# EAGLE design status_led_base (EAGLE 6.6.0)
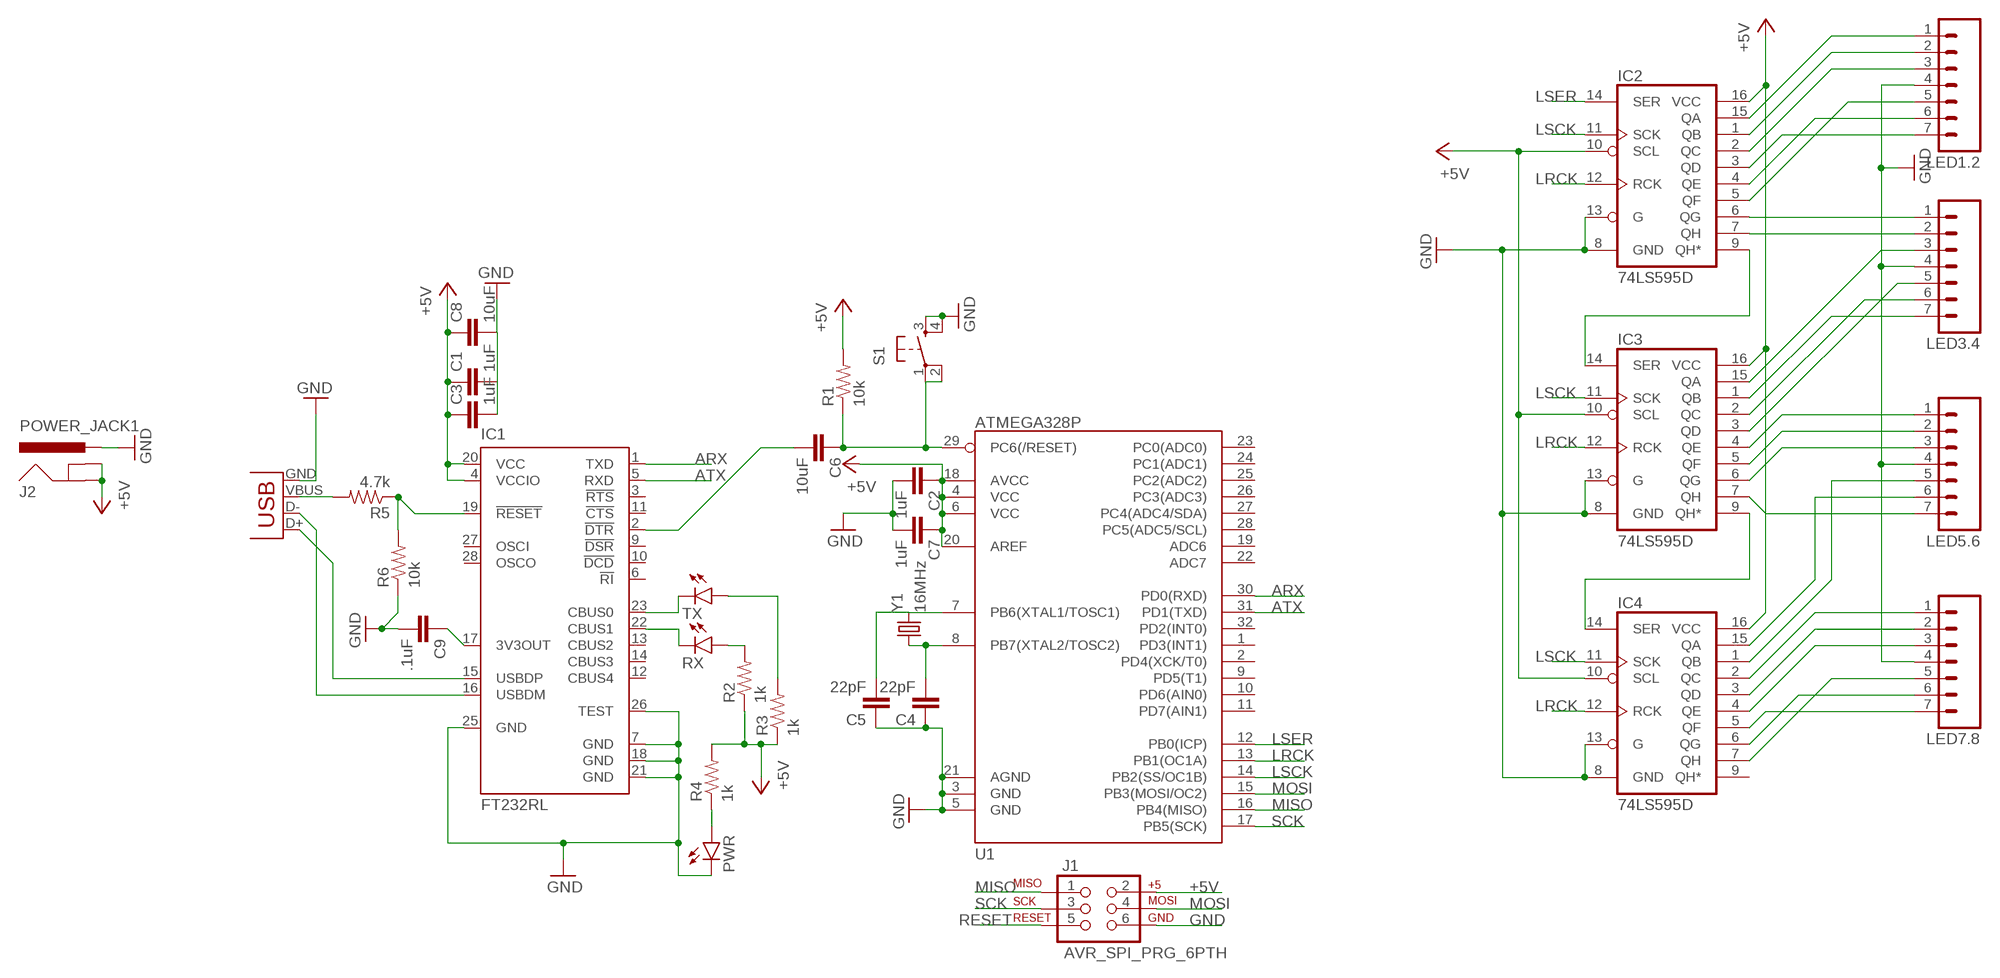
[diagram p0: schematic, sheet 1]

## Parts
C1  1uF  CAP0603-CAP  [0603-CAP]
C2  1uF  CAP0603-CAP  [0603-CAP]
C3  1uF  CAP0603-CAP  [0603-CAP]
C4  22pF  CAP0603-CAP  [0603-CAP]
C5  22pF  CAP0603-CAP  [0603-CAP]
C6  10uF  CAP0603-CAP  [0603-CAP]
C7  1uF  CAP0603-CAP  [0603-CAP]
C8  10uF  CAP0603-CAP  [0603-CAP]
C9  .1uF  CAP0603-CAP  [0603-CAP]
IC1  FT232RL  [SSOP28]
IC2  74LS595D  [SO16]
IC3  74LS595D  [SO16]
IC4  74LS595D  [SO16]
J1  AVR_SPI_PRG_6PTH  [2X3]
J2  POWER_JACK1  [POWER_JACK_SMD_OVERPASTE_REDBOARD_0603]
JP1  USBSMD  [USB-MINIB]
LED1.2  M07  [1X07]
LED3.4  M07  [1X07]
LED5.6  M07  [1X07]
LED7.8  M07  [1X07]
PWR  LED0603  [LED-0603]
R1  10k  RESISTOR0603-RES  [0603-RES]
R2  1k  RESISTOR0603-RES  [0603-RES]
R3  1k  RESISTOR0603-RES  [0603-RES]
R4  1k  RESISTOR0603-RES  [0603-RES]
R5  4.7k  RESISTOR0603-RES  [0603-RES]
R6  10k  RESISTOR0603-RES  [0603-RES]
RX  LED0603  [LED-0603]
S1  TAC_SWITCHSMD  [TACTILE-SWITCH-SMD]
TX  LED0603  [LED-0603]
U1  ATMEGA328P  ATMEGA328_SMT  [TQFP32-08]
Y1  16MHz  CRYSTALSMD  [HC49UP]

## Nets
+5V: C1.1 C2.1 C3.1 C7.1 C8.1 IC1.4(VCCIO) IC1.20(VCC) IC2.10(SCL) IC2.16(VCC) IC3.10(SCL) IC3.16(VCC) IC4.10(SCL) IC4.16(VCC) J1.2 J2.GND(GNDBREAK) J2.P$4(GND) R1.2 R2.1 R3.1 R4.2 U1.4(VCC) U1.6(VCC) U1.18(AVCC) U1.20(AREF)
ARX: IC1.1(TXD) U1.30(PD0(RXD))
ATX: IC1.5(RXD) U1.31(PD1(TXD))
GND: C1.2 C2.2 C3.2 C4.1 C5.1 C7.2 C8.2 C9.2 IC1.7(GND) IC1.18(GND) IC1.21(GND) IC1.25(GND) IC1.26(TEST) IC2.8(GND) IC2.13(G) IC3.8(GND) IC3.13(G) IC4.8(GND) IC4.13(G) J1.6 J2.VIN0(PWR) JP1.GND LED1.2.4 LED3.4.4 LED5.6.4 LED7.8.4 PWR.C R6.1 S1.3 S1.4 U1.3(GND) U1.5(GND) U1.21(AGND)
LRCK: IC2.12(RCK) IC3.12(RCK) IC4.12(RCK) U1.13(PB1(OC1A))
LSCK: IC2.11(SCK) IC3.11(SCK) IC4.11(SCK) U1.14(PB2(SS/OC1B))
LSER: IC2.14(SER) U1.12(PB0(ICP))
MISO: J1.1 U1.16(PB4(MISO))
MOSI: J1.4 U1.15(PB3(MOSI/OC2))
N$1: IC1.16(USBDM) JP1.D-
N$2: IC1.15(USBDP) JP1.D+
N$3: IC4.15(QA) LED5.6.6
N$4: R3.2 TX.A
N$5: R2.2 RX.A
N$6: C6.2 IC1.2(!DTR)
N$7: PWR.A R4.1
N$8: IC2.15(QA) LED1.2.1
N$9: IC1.23(CBUS0) TX.C
N$10: IC1.22(CBUS1) RX.C
N$11: C9.1 IC1.17(3V3OUT)
N$12: JP1.VBUS R5.2
N$13: C5.2 U1.7(PB6(XTAL1/TOSC1)) Y1.2
N$14: C4.2 U1.8(PB7(XTAL2/TOSC2)) Y1.1
N$15: IC2.1(QB) LED1.2.2
N$16: IC2.2(QC) LED1.2.3
N$17: IC2.3(QD) LED1.2.7
N$18: IC2.4(QE) LED1.2.6
N$19: IC2.5(QF) LED1.2.5
N$20: IC2.9(QH*) IC3.14(SER)
N$21: IC3.9(QH*) IC4.14(SER)
N$23: IC2.6(QG) LED3.4.1
N$24: IC2.7(QH) LED3.4.2
N$25: IC3.15(QA) LED3.4.3
N$26: IC3.1(QB) LED3.4.7
N$27: IC3.2(QC) LED3.4.6
N$28: IC3.3(QD) LED3.4.5
N$29: IC3.4(QE) LED5.6.1
N$30: IC3.5(QF) LED5.6.2
N$31: IC3.6(QG) LED5.6.3
N$32: IC3.7(QH) LED5.6.7
N$33: IC4.1(QB) LED5.6.5
N$34: IC4.2(QC) LED7.8.1
N$35: IC4.3(QD) LED7.8.2
N$36: IC4.4(QE) LED7.8.3
N$37: IC4.5(QF) LED7.8.7
N$38: IC4.6(QG) LED7.8.6
N$39: IC4.7(QH) LED7.8.5
N$40: IC1.19(!RESET) R5.1 R6.2
RESET: C6.1 J1.5 R1.1 S1.1 S1.2 U1.29(PC6(/RESET))
SCK: J1.3 U1.17(PB5(SCK))
Unconnected: IC1.3(!RTS) IC1.6(!RI) IC1.9(!DSR) IC1.10(!DCD) IC1.11(!CTS) IC1.12(CBUS4) IC1.13(CBUS2) IC1.14(CBUS3) IC1.27(OSCI) IC1.28(OSCO) IC4.9(QH*) U1.1(PD3(INT1)) U1.2(PD4(XCK/T0)) U1.9(PD5(T1)) U1.10(PD6(AIN0)) U1.11(PD7(AIN1)) U1.19(ADC6) U1.22(ADC7) U1.23(PC0(ADC0)) U1.24(PC1(ADC1)) U1.25(PC2(ADC2)) U1.26(PC3(ADC3)) U1.27(PC4(ADC4/SDA)) U1.28(PC5(ADC5/SCL)) U1.32(PD2(INT0))

## Library data of the parts
C1-C9 = SparkFun-Capacitors:CAP: Capacitor Standard 0603 ceramic capacitor, and 0.1" leaded capacitor.
IC1 = ftdichip:FT232R: Source: http://www.ftdichip.com/Documents/DataSheets/DS_FT232R_v104.pdf; MPN: FT232RL; OC_FARNELL: 1146032; OC_NEWARK: 91K9918
IC2-IC4 = SparkFun-DigitalIC:74*595: 8-bit SHIFT REGISTER, output latch; PROD_ID: IC-07875
J1 = SparkFun-Connectors:AVR_SPI_PRG_6: AVR ISP 6 Pin This is the reduced ISP connector for AVR programming. Common on Arduino. This footprint will take up less PCB space and can be used with a 10-pin to 6-pin adapter such as SKU: BOB-08508 **Special note about "TEST_POINT" package. The stop mask is on the top side, so if you want your programming test points to be on the bottom of your board, make sure to place this package on the bottom side of the board. This also ensure that the orientation to program from the bottom side will be correct.
J2 = SparkFun-Connectors:POWER_JACK: Power Jack This is the standard 5.5mm barrel jack for power. The PTH is the most common, proven, reliable, footprint. The Slot footprint only works if the mill layer is transmitted to the PCB fab house so be warned. Mating wall wart : TOL-00298 (and others)
JP1 = SparkFun-Connectors:USB: USB Connectors USB-B-PTH is fully proven SKU : PRT-00139/CONN-08278 USB-miniB is fully proven SKU : PRT-00587 USB-A-PCB is untested. USB-A-H is throughly reviewed, but untested. Spark Fun Electronics SKU : PRT-00437 USB-B-SMT is throughly reviewed, but untested. Needs silkscreen touching up. USB-A-S has not been used/tested USB-MB-H has not been used/tested USB-MICROB has been used. CONN-09505; PROD_ID: CONN-08193
LED1.2 LED3.4 LED5.6 LED7.8 = SparkFun-Connectors:M07: Header 7 Standard 7-pin 0.1" header. Use with straight break away headers (SKU : PRT-00116), right angle break away headers (PRT-00553), swiss pins (PRT-00743), machine pins (PRT-00117), and female headers (PRT-00115). NOTES ON THE VARIANTS LOCK and LOCK_LONGPADS... This footprint was designed to help hold the alignment of a through-hole component (i.e. 7-pin header) while soldering it into place. You may notice that each hole has been shifted either up or down by 0.005 of an inch from it's more standard position (which is usually a perfectly straight line). This slight alteration caused the pins (the squares in the middle) to touch the edges of the holes. Because they are alternating, it causes a "brace" to hold the header in place. 0.005 has proven to be the perfect amount of "off-center" position when using our standard breakaway headers. Although looks a little odd when you look at the bare footprint, once you have a header in there, the alteration is very hard to notice. Also, if you push a header all the way into place, it is covered up entirely on the bottom side. This idea of altering the position of holes to aid alignment will be further integrated into the Sparkfun Library for other footprints. It can help hold any component with 3 or more connection pins.
PWR RX TX = SparkFun-LED:LED: LEDs Standard schematic elements and footprints for 5mm, 3mm, 1206, and 0603 sized LEDs. 5mm - Spark Fun Electronics SKU : COM-00529 (and others)
R1-R6 = SparkFun-Passives:RESISTOR: Resistor Basic schematic elements and footprints for 0603, 1206, and PTH resistors.
S1 = SparkFun-Electromechanical:TAC_SWITCH: Momentary Switch Button commonly used for reset or general input. Spark Fun Electronics SKU : COM-00097 SMT- SWCH-08247
U1 = SparkFun-DigitalIC:ATMEGA328_SMT: 32-Pin Atmega328 part Commonly used on Arduino compatible boards Available in QFP and QFN packages TQFP is IC-09069 QFN is non-stock; PROD_ID: IC-09069
Y1 = SparkFun-FreqCtrl:CRYSTAL: Various standard crystals. Proven footprints. Spark Fun Electronics SKU : COM-00534

## Board
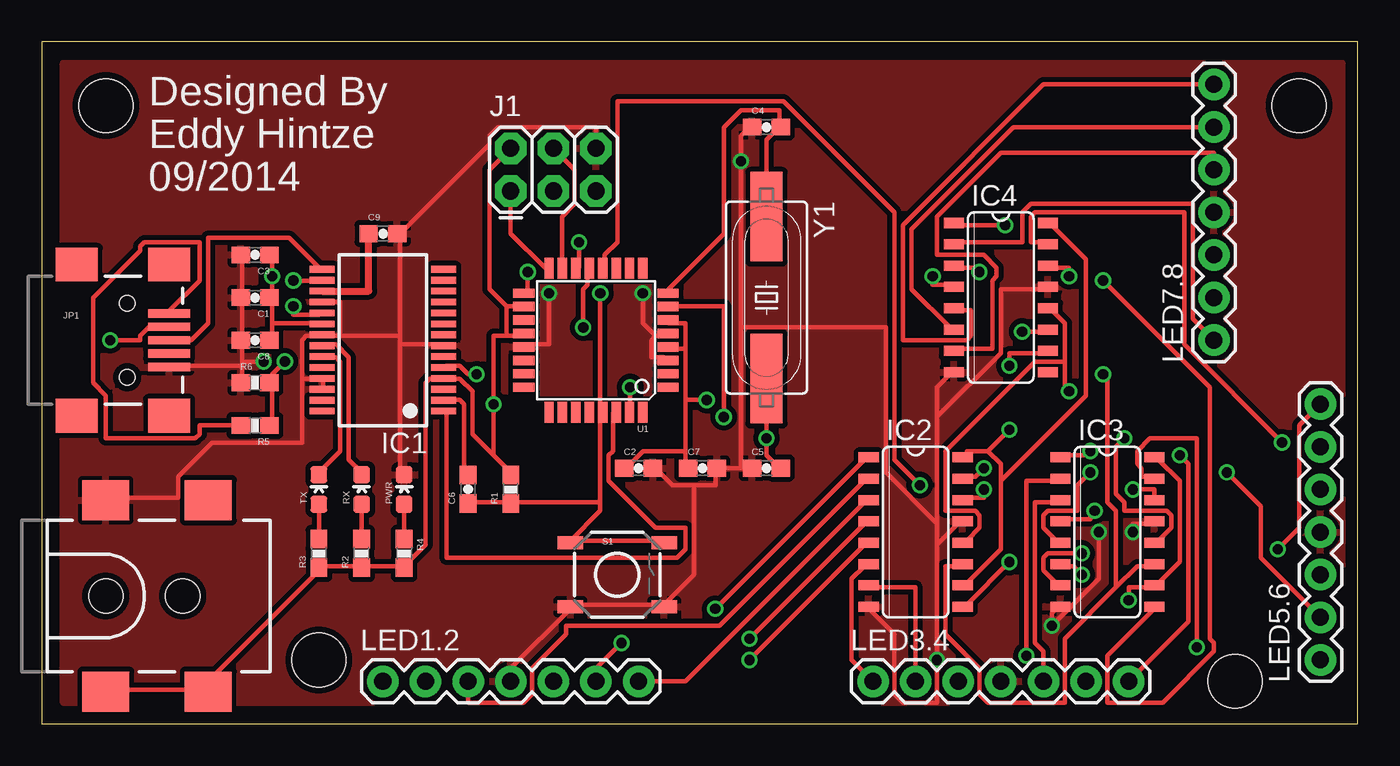
[diagram p1: board, top side]
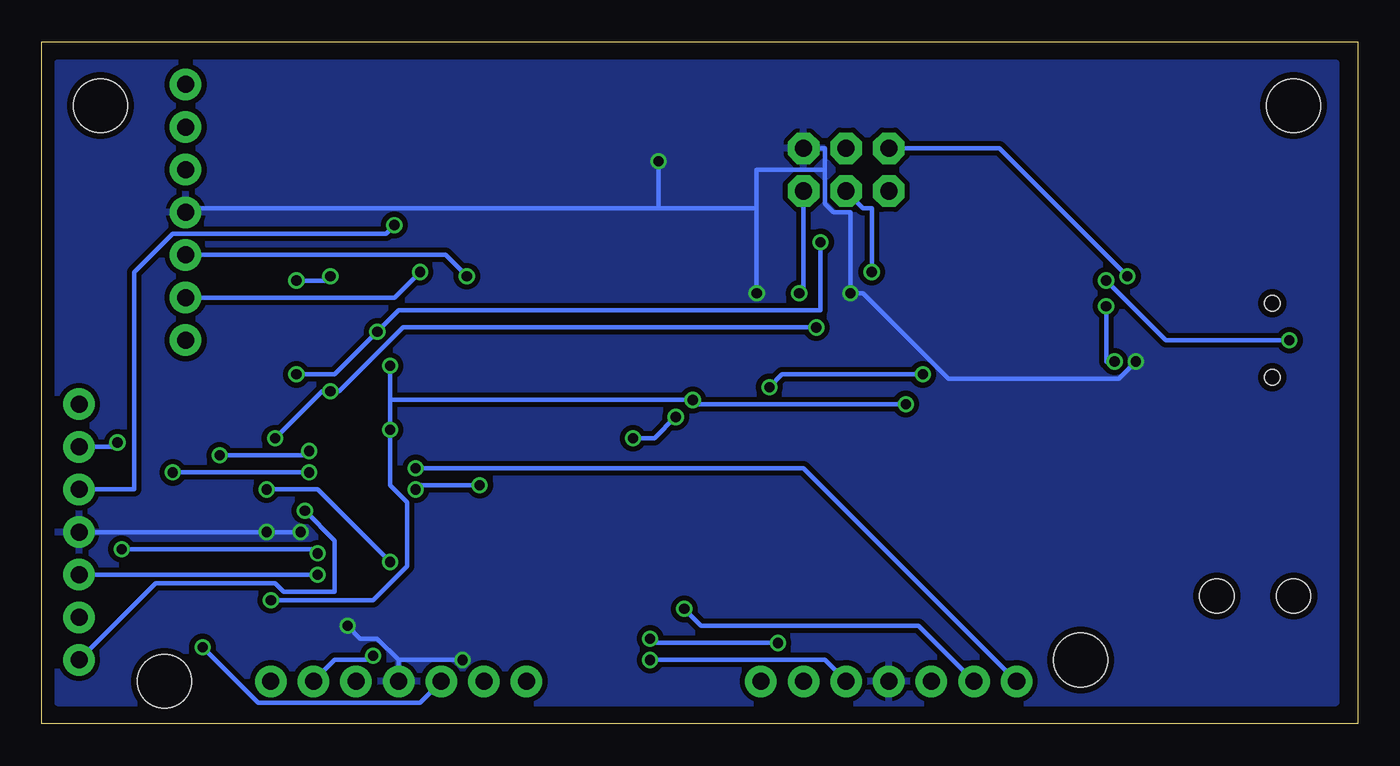
[diagram p2: board, bottom side, seen from below]

Size 78.41 x 40.63 mm. Coordinates in mm from the lower left corner, seen from the top.
Outline: 0,0 78.41,0 78.41,40.63 0,40.63 0,0
Copper layers (1*16): Top 0.0356mm / dielectric 1.5011mm / Bottom 0.0356mm
Design rules "LaenPCBOrder": minimum track width 6mil, minimum drill 13mil, track to track 6mil, track to pad 6mil, pad to pad 6mil, via to via 6mil, smd to smd 6mil, copper to edge 15mil, drill to drill 6mil, minimum pad ring 7mil, minimum via ring 7mil, stop-mask expansion 3mil, vias tented up to drill 0mil, thermal gap 10mil
Holes 3.2 mm at 3.81,36.83 74.93,36.83 71.12,2.54 16.51,3.81

### Footprints (pad centres in the part's own frame; a part is rotated, then mirrored left to right if it is on the bottom)
0603-CAP = smd 1.1 x 1: 1 -0.85,0; 2 0.85,0
SSOP28 = smd 0.4 x 1.5: 1 -4.225,-3.625; 2 -3.575,-3.625; 3 -2.925,-3.625; 4 -2.275,-3.625; 5 -1.625,-3.625; 6 -0.975,-3.625; 7 -0.325,-3.625; 8 0.325,-3.625; 9 0.975,-3.625; 10 1.625,-3.625; 11 2.275,-3.625; 12 2.925,-3.625; 13 3.575,-3.625; 14 4.225,-3.625; 15 4.225,3.625; 16 3.575,3.625; 17 2.925,3.625; 18 2.275,3.625; 19 1.625,3.625; 20 0.975,3.625; 21 0.325,3.625; 22 -0.325,3.625; 23 -0.975,3.625; 24 -1.625,3.625; 25 -2.275,3.625; 26 -2.925,3.625; 27 -3.575,3.625; 28 -4.225,3.625
SO16 = smd 0.6 x 1.2: 1 -4.445,-2.8; 2 -3.175,-2.8; 3 -1.905,-2.8; 4 -0.635,-2.8; 5 0.635,-2.8; 6 1.905,-2.8; 7 3.175,-2.8; 8 4.445,-2.8; 9 4.445,2.8; 10 3.175,2.8; 11 1.905,2.8; 12 0.635,2.8; 13 -0.635,2.8; 14 -1.905,2.8; 15 -3.175,2.8; 16 -4.445,2.8
2X3 = drill 1.016 pad 1.88 octagon: 1 0,0; 2 0,2.54; 3 2.54,0; 4 2.54,2.54; 5 5.08,0; 6 5.08,2.54
POWER_JACK_SMD_OVERPASTE_REDBOARD_0603 = smd 2.8 x 2.4: GND 0,-5.7; P$4 6.1,-5.7; VIN0 0,5.7; VIN1 6.1,5.7 | hole 2.032: 0,0; 4.572,0
USB-MINIB = smd 2.5 x 0.5: D+ 2.5,0; D- 2.5,0.8; GND 2.5,-1.6; ID 2.5,-0.8; VBUS 2.5,1.6 | smd 2.5 x 2: MTN1 -3,4.5; MTN2 2.5,4.5; MTN3 -3,-4.5; MTN4 2.5,-4.5 | hole 0.9: 0,2.2; 0,-2.2
1X07 = drill 1.016 pad 1.88: 1 0,0; 2 2.54,0; 3 5.08,0; 4 7.62,0; 5 10.16,0; 6 12.7,0; 7 15.24,0
LED-0603 = smd 1 x 1: A 0,-0.877; C 0,0.877
0603-RES = smd 1.1 x 1: 1 -0.85,0; 2 0.85,0
TACTILE-SWITCH-SMD = smd 1.524 x 0.762: 1 -2.794,1.905; 2 2.794,1.905; 3 -2.794,-1.905; 4 2.794,-1.905
TQFP32-08 = smd 1.27 x 0.559: 1 -4.293,2.8; 2 -4.293,2; 3 -4.293,1.2; 4 -4.293,0.4; 5 -4.293,-0.4; 6 -4.293,-1.2; 7 -4.293,-2; 8 -4.293,-2.8; 17 4.293,-2.8; 18 4.293,-2; 19 4.293,-1.2; 20 4.293,-0.4; 21 4.293,0.4; 22 4.293,1.2; 23 4.293,2; 24 4.293,2.8 | smd 0.559 x 1.27: 9 -2.8,-4.293; 10 -2,-4.293; 11 -1.2,-4.293; 12 -0.4,-4.293; 13 0.4,-4.293; 14 1.2,-4.293; 15 2,-4.293; 16 2.8,-4.293; 25 2.8,4.293; 26 2,4.293; 27 1.2,4.293; 28 0.4,4.293; 29 -0.4,4.293; 30 -1.2,4.293; 31 -2,4.293; 32 -2.8,4.293
HC49UP = smd 5.334 x 1.93: 1 -4.826,0; 2 4.826,0

### Placement (x,y rotation side)
C1  12.7,25.4 180 top
C2  35.56,15.24 0 top
C3  12.7,27.94 180 top
C4  43.18,35.56 0 top
C5  43.18,15.24 0 top
C6  25.4,13.97 90 top
C7  39.37,15.24 0 top
C8  12.7,22.86 180 top
C9  20.32,29.21 0 top
IC1  20.32,22.86 90 top
IC2  52.07,11.43 270 top
IC3  63.5,11.43 270 top
IC4  57.15,25.4 270 top
J1  27.94,31.75 0 top
J2  3.81,7.62 0 top
JP1  5.08,22.86 0 top
LED1.2  20.32,2.54 0 top
LED3.4  49.53,2.54 0 top
LED5.6  76.2,3.81 90 top
LED7.8  69.85,22.86 90 top
PWR  21.59,13.97 0 top
R1  27.94,13.97 90 top
R2  19.05,10.16 90 top
R3  16.51,10.16 90 top
R4  21.59,10.16 270 top
R5  12.7,17.78 180 top
R6  12.7,20.32 0 top
RX  19.05,13.97 0 top
S1  34.29,8.89 0 top
TX  16.51,13.97 0 top
U1  33.02,22.86 180 top
Y1  43.18,25.4 270 top

### Tracks (layer width: path | path; a pad name or v marks a point on that pad's centre or on a via)
+5V  (via drill 0.61)
  Top 0.254: 38.35,16.26 35.81,16.26 34.8,15.24 C2.1 | 38.35,16.26 38.35,15.24 C7.1 | 38.35,22.35 37.34,22.35 U1.4 | 38.35,16.26 38.35,19.3 | 38.35,19.3 38.35,22.35 | 38.35,22.35 38.35,23.88 37.34,23.88 U1.6 | IC3.16 66.55,15.75 67.82,14.48 67.82,9.65 66.55,8.38 IC3.10 66.29,8.13 64.77,8.13 v64.77,7.37 | 57.15,14.48 57.15,15.49 56.39,16.26 | 57.15,14.48 57.15,10.41 55.12,8.38 IC2.10 | 56.39,16.26 55.12,16.26 55.12,16 IC2.16 | v57.66,21.34 57.66,22.1 59.94,22.1 IC4.10 | 56.39,16.26 v57.66,17.53 | 57.15,14.48 62.23,19.56 62.23,27.69 60.2,29.72 IC4.16 | v39.62,19.3 38.35,19.3 | 19.05,9.4 16.51,9.4 R3.1 16.51,9.14 10.16,2.79 10.16,2.03 J2.P$4 9.91,2.03 3.81,2.03 J2.GND | 19.05,9.4 21.59,9.4 | 19.05,9.4 R2.1 | 13.72,25.4 13.72,23.88 | 13.72,23.88 13.72,22.86 C8.1 | 13.72,25.4 v13.72,26.67 13.72,27.94 C3.1 | 13.72,25.4 C1.1 | 13.72,23.88 16.51,23.88 IC1.20 | 26.92,16 25.65,17.27 25.65,19.81 24.89,20.57 24.13,20.57 IC1.4 23.88,20.57 23.11,20.57 22.86,20.32 22.86,10.67 21.59,9.4 | 26.92,16 27.94,14.99 R1.2 | 27.69,23.11 26.92,23.11 v26.92,19.05 26.92,16 | 27.69,23.11 28.7,23.11 U1.20 | 27.69,24.89 28.7,24.89 U1.18 | 27.69,23.11 27.69,24.89 | J1.2 26.67,33.02 26.67,25.91 27.69,24.89 | 21.59,9.4 R4.2
  Bottom 0.254: 57.66,19.3 v57.66,17.53 57.66,14.22 56.64,13.21 56.64,9.4 58.67,7.37 v64.77,7.37 | 57.66,19.3 v57.66,21.34 | 57.66,19.3 v39.62,19.3 39.37,19.05 v26.92,19.05 | v13.72,26.67 21.34,34.29 J1.2
ARX
  Top 0.254: U1.30 34.04,18.54 34.04,16.26 33.78,16 33.78,14.48 36.58,11.68 38.35,11.68 38.35,10.41 37.85,9.91 24.13,9.91 24.13,18.54 IC1.1
ATX  (via drill 0.61)
  Top 0.254: v35.05,20.07 35.05,18.8 U1.31 | v25.91,20.83 25.4,20.83 24.89,21.34 24.13,21.34 IC1.5
  Bottom 0.254: v35.05,20.07 34.29,20.83 v25.91,20.83
GND  (via drill 0.61)
  Top 0.254: 37.08,7.11 31.5,7.11 S1.3 31.5,6.86 27.94,3.3 LED1.2.4 | 38.86,14.22 40.13,14.22 40.13,15.24 C7.2 41.66,15.24 | 38.86,14.22 37.59,14.22 36.58,15.24 C2.2 | 41.66,15.24 C5.1 | 41.66,15.24 41.66,23.62 | 41.66,23.62 v41.66,33.53 41.66,35.05 42.16,35.56 C4.1 | 37.08,7.11 38.86,8.89 38.86,14.22 | 37.08,7.11 S1.4 | v65.02,11.43 65.02,11.94 66.29,11.94 IC3.13 | IC3.8 60.45,6.86 60.2,6.6 v60.2,5.84 62.99,8.64 v62.99,11.43 | 53.34,10.67 v53.34,3.81 53.34,1.27 51.31,1.27 50.8,1.78 50.8,5.33 49.28,6.86 IC2.8 | 53.34,10.67 54.86,12.19 IC2.13 | 53.34,10.67 53.34,11.94 | 53.34,11.94 53.34,18.29 | 53.34,18.29 53.34,20.07 54.1,20.83 IC4.8 | 53.34,18.29 57.15,22.1 57.15,25.91 59.94,25.91 IC4.13 | 41.66,23.62 50.29,23.62 50.29,14.99 53.34,11.94 | IC1.26 16.76,20.07 16.76,20.57 IC1.25 16.51,20.57 15.49,20.57 | 21.34,29.21 21.34,23.11 | 21.34,23.11 21.34,22.61 | 21.34,22.61 21.34,15.24 21.59,14.99 PWR.C | 21.34,23.11 17.78,23.11 | 17.78,23.11 16.76,23.11 IC1.21 16.51,23.11 15.75,23.11 15.49,22.86 15.49,20.57 | 17.78,23.11 17.78,25.15 16.76,25.15 IC1.18 | 21.34,22.61 23.88,22.61 IC1.7 | 15.49,20.57 15.49,16.76 10.16,16.76 8.13,14.73 8.13,13.46 3.81,13.46 J2.VIN0 | 11.94,22.86 11.94,21.59 | 11.94,21.59 11.94,21.34 | 11.94,21.34 11.94,20.32 R6.1 | 11.94,25.4 11.94,27.94 C3.2 | 11.94,25.4 11.94,22.86 | 11.94,22.86 C8.2 | 11.94,25.4 C1.2 | 11.94,21.34 7.62,21.34 JP1.GND | 36.58,23.11 36.32,22.86 36.32,21.84 37.08,21.84 U1.3 | 36.58,23.11 37.08,23.11 U1.5 | v30.23,25.65 30.23,22.61 28.96,22.61 U1.21 | 36.58,23.11 35.81,23.88 v35.81,25.65 | v13.21,21.59 11.94,21.59 | 21.34,29.21 26.67,34.54 26.67,35.05 27.18,35.56 33.02,35.56 J1.6
  Top 0.254: 21.34,29.21 C9.2
  Bottom 0.254: LED5.6.4 v65.02,11.43 v62.99,11.43 | v60.2,5.84 59.44,5.08 58.42,5.08 57.15,3.81 | LED3.4.4 57.15,3.81 | v53.34,3.81 57.15,3.81 | 31.75,33.02 31.75,34.29 J1.6 | 31.75,33.02 31.75,30.99 31.24,30.48 30.23,30.48 v30.23,25.65 29.46,25.65 24.38,20.57 14.22,20.57 v13.21,21.59 | 35.81,30.73 35.81,33.02 31.75,33.02 | 35.81,30.73 v35.81,25.65 | LED7.8.4 69.6,30.73 41.66,30.73 | 35.81,30.73 41.66,30.73 | 41.66,30.73 v41.66,33.53
  pour Bottom (isolate 0.305): 1.27,39.37 77.47,39.37 77.47,1.27 1.27,1.27
  pour Top (isolate 0.305): 1.27,39.37 77.47,39.37 77.47,1.27 1.27,1.27
LRCK  (via drill 0.61)
  Top 0.254: 60.96,21.59 59.18,21.59 53.85,16.26 53.85,12.7 55.63,12.7 55.88,12.45 55.88,11.68 55.12,10.92 IC2.12 | 60.96,21.59 60.96,23.88 60.2,24.64 IC4.12 | v64.52,17.02 64.01,16.51 64.01,13.72 64.52,13.21 64.52,12.7 67.06,12.7 67.31,12.45 67.31,11.68 66.55,10.92 IC3.12 | v61.21,19.81 60.96,20.07 60.96,21.59 | v32.26,23.62 32.26,25.91 32.51,26.16 32.51,26.92 U1.13
  Bottom 0.254: v64.52,17.02 61.72,19.81 v61.21,19.81 60.71,19.81 56.9,23.62 v32.26,23.62
LSCK  (via drill 0.61)
  Top 0.254: 64.01,8.13 65.28,9.4 66.29,9.4 IC3.11 | 64.01,8.13 60.96,5.08 60.96,1.27 56.39,1.27 55.88,1.78 55.88,3.3 53.85,5.33 53.85,9.4 54.86,9.4 IC2.11 | v58.42,23.37 59.94,23.37 IC4.11 | v63.25,20.83 63.5,20.57 63.5,13.21 64.01,12.7 64.01,8.13 | v32,28.7 32,27.18 U1.14
  Bottom 0.254: v63.25,20.83 60.96,20.83 v58.42,23.37 57.15,24.64 32,24.64 v32,28.7
LSER  (via drill 0.61)
  Top 0.254: v56.13,13.97 56.13,13.46 55.12,13.46 IC2.14 | v52.32,14.22 50.8,15.75 50.8,30.48 44.2,37.08 34.29,37.08 34.29,28.7 33.53,27.94 33.53,27.18 U1.12
  Bottom 0.254: v56.13,13.97 55.88,14.22 v52.32,14.22
MISO
  Top 0.254: J1.1 27.94,29.21 29.97,27.18 U1.16
MOSI
  Top 0.254: J1.4 31.75,33.02 31.75,30.99 30.99,30.23 30.99,27.18 U1.15
N$1  (via drill 0.61)
  Top 0.254: v14.99,26.42 16.51,26.42 IC1.16 | v4.06,22.86 5.84,22.86 5.84,23.11 6.35,23.62 7.37,23.62 JP1.D-
  Bottom 0.254: v14.99,26.42 11.43,22.86 v4.06,22.86
N$2
  Top 0.254: JP1.D+ 8.89,22.86 9.91,23.88 9.91,28.96 14.73,28.96 16.51,27.18 IC1.15
N$3  (via drill 0.61)
  Top 0.254: v73.91,16.76 68.07,22.61 68.07,30.48 59.18,30.48 58.93,30.23 58.93,28.7 59.94,28.7 IC4.15
  Bottom 0.254: v73.91,16.76 74.17,16.51 LED5.6.6
N$4
  Top 0.254: R3.2 TX.A
N$5
  Top 0.254: R2.2 RX.A
N$6
  Top 0.254: C6.2 25.4,14.99 25.15,15.24 25.15,19.05 24.89,19.3 24.13,19.3 IC1.2
N$7
  Top 0.254: R4.1 PWR.A
N$8  (via drill 0.61)
  Top 0.254: v56.13,15.24 55.63,14.73 55.12,14.73 IC2.15
  Bottom 0.254: v56.13,15.24 33.02,15.24 LED1.2.1
N$9
  Top 0.254: TX.C 16.51,14.99 17.78,16.26 17.78,21.59 17.53,21.84 16.76,21.84 IC1.23
N$10
  Top 0.254: RX.C 19.05,14.99 18.29,15.75 18.29,21.84 17.53,22.61 16.76,22.61 IC1.22
N$11
  Top 0.406: IC1.17 19.47,25.79 C9.1
N$12
  Top 0.254: R5.2 9.4,17.78 9.4,17.27 9.14,17.02 3.81,17.02 3.81,19.56 3.05,20.32 3.05,25.4 5.84,28.19 5.84,28.45 6.1,28.7 9.4,28.7 9.4,26.42 7.62,24.64 JP1.VBUS
N$13  (via drill 0.61)
  Top 0.254: Y1.2 v43.18,17.02 43.18,16 43.94,15.24 C5.2 | v40.64,18.29 40.64,24.89 37.34,24.89 U1.7
  Bottom 0.254: v40.64,18.29 41.91,17.02 v43.18,17.02
N$14
  Top 0.254: 43.94,35.56 43.18,34.8 Y1.1 | 43.94,35.56 43.94,36.58 41.66,36.58 40.64,35.56 40.64,29.21 37.34,25.91 U1.8 | 43.94,35.56 C4.2
N$15  (via drill 0.61)
  Top 0.254: v40.13,6.86 49.02,15.75 IC2.1
  Bottom 0.254: v40.13,6.86 39.12,5.84 26.16,5.84 LED1.2.2
N$16
  Top 0.254: LED1.2.3 25.4,1.27 28.7,1.27 29.21,1.78 29.21,3.3 31.24,5.33 31.24,5.84 40.39,5.84 49.02,14.48 IC2.2
N$17
  Top 0.254: LED1.2.7 38.35,2.54 49.02,13.21 IC2.3
N$18  (via drill 0.61)
  Top 0.254: v42.16,5.08 49.02,11.94 IC2.4 | v34.54,4.83 33.02,3.3 LED1.2.6
  Bottom 0.254: v42.16,5.08 41.91,4.83 v34.54,4.83
N$19  (via drill 0.61)
  Top 0.254: v42.16,3.81 49.02,10.67 IC2.5
  Bottom 0.254: v42.16,3.81 31.75,3.81 LED1.2.5
N$20  (via drill 0.61)
  Top 0.254: v57.66,9.65 55.12,7.11 IC2.9 | v65.02,13.97 66.29,13.97 66.29,13.46 IC3.14
  Bottom 0.254: v57.66,9.65 61.98,13.97 v65.02,13.97
N$21  (via drill 0.61)
  Top 0.254: v61.21,26.67 61.21,27.18 60.2,27.18 IC4.14 | v63.25,26.42 69.6,20.07 69.6,5.08 69.85,4.83 69.85,4.32 66.8,1.27 63.5,1.27 63.5,4.06 66.29,6.86 IC3.9
  Bottom 0.254: v61.21,26.67 61.47,26.42 v63.25,26.42
N$23
  Top 0.254: LED3.4.1 48.26,3.81 48.26,8.64 49.02,9.4 IC2.6
N$24
  Top 0.254: LED3.4.2 52.07,8.13 49.28,8.13 IC2.7
N$25  (via drill 0.61)
  Top 0.254: v68.83,4.57 68.83,17.02 66.04,17.02 65.28,16.26 65.28,15.49 65.53,15.24 65.53,14.73 66.29,14.73 IC3.15
  Bottom 0.254: v68.83,4.57 65.53,1.27 55.88,1.27 LED3.4.3
N$26  (via drill 0.61)
  Top 0.254: v62.48,16.26 62.48,16 60.71,16 IC3.1 | v67.82,16 68.33,15.49 68.33,6.1 LED3.4.7
  Bottom 0.254: v62.48,16.26 62.74,16 v67.82,16
N$27  (via drill 0.61)
  Top 0.254: v58.67,4.06 58.67,14.48 60.45,14.48 IC3.2
  Bottom 0.254: v58.67,4.06 58.93,3.81 60.96,3.81 LED3.4.6
N$28
  Top 0.254: LED3.4.5 59.69,4.32 59.18,4.83 59.18,13.21 60.45,13.21 IC3.3
N$29  (via drill 0.61)
  Top 0.254: v62.74,12.7 62.48,12.45 62.48,12.19 60.71,12.19 IC3.4
  Bottom 0.254: v62.74,12.7 60.96,10.92 60.96,7.87 64.01,7.87 64.52,8.38 71.63,8.38 LED5.6.1
N$30  (via drill 0.61)
  Top 0.254: v62.48,14.99 61.72,14.22 61.72,12.7 59.94,12.7 59.69,12.45 59.69,11.68 60.45,10.92 IC3.5 | v70.61,14.99 72.64,12.95 72.64,9.91 LED5.6.2
  Bottom 0.254: v70.61,14.99 v62.48,14.99
N$31  (via drill 0.61)
  Top 0.254: v61.98,8.89 61.47,9.4 60.71,9.4 IC3.6
  Bottom 0.254: LED5.6.3 v61.98,8.89
N$32  (via drill 0.61)
  Top 0.254: v61.98,10.16 59.94,10.16 59.69,9.91 59.69,9.14 60.45,8.38 IC3.7 | v73.66,10.41 74.93,11.68 74.93,17.78 LED5.6.7
  Bottom 0.254: v61.98,10.16 62.23,10.41 v73.66,10.41
N$33  (via drill 0.61)
  Top 0.254: v57.4,29.72 54.36,29.72 IC4.1
  Bottom 0.254: v57.4,29.72 57.91,29.21 70.61,29.21 72.9,26.92 72.9,13.97 LED5.6.5
N$34
  Top 0.254: LED7.8.1 68.58,24.13 68.58,30.99 58.93,30.99 58.42,30.48 58.42,28.7 54.36,28.7 IC4.2
N$35  (via drill 0.61)
  Top 0.254: v55.88,26.92 55.88,27.18 54.36,27.18 IC4.3
  Bottom 0.254: v55.88,26.92 57.4,25.4 LED7.8.2
N$36  (via drill 0.61)
  Top 0.254: v53.09,26.67 53.09,26.16 54.1,26.16 IC4.4
  Bottom 0.254: v53.09,26.67 54.36,27.94 LED7.8.3
N$37
  Top 0.254: LED7.8.7 59.69,38.1 51.31,29.72 51.31,22.86 55.12,22.86 55.37,23.11 55.37,24.64 54.36,24.64 IC4.5
N$38
  Top 0.254: LED7.8.6 57.91,35.56 51.82,29.46 51.82,25.91 54.1,23.62 IC4.6
N$39
  Top 0.254: LED7.8.5 69.85,34.04 57.15,34.04 53.34,30.23 53.34,27.94 56.13,27.94 56.9,27.18 56.9,26.67 56.64,26.42 56.64,22.35 54.36,22.35 IC4.7
N$40  (via drill 0.61)
  Top 0.254: 13.72,20.32 13.72,17.78 R5.1 | v14.99,24.89 14.99,24.38 16.51,24.38 IC1.19 | v14.48,21.59 13.72,20.83 13.72,20.32 | 13.72,20.32 R6.2
  Bottom 0.254: v14.99,24.89 14.99,21.59 v14.48,21.59
RESET  (via drill 0.61)
  Top 0.254: 27.94,13.21 25.4,13.21 C6.1 | 33.27,13.21 33.27,12.7 31.5,10.92 | 33.27,13.21 33.27,18.54 U1.29 33.27,18.8 v33.27,25.65 | 31.5,10.92 37.08,10.92 S1.2 | 31.5,10.92 S1.1 | 33.27,13.21 27.94,13.21 | 27.94,13.21 R1.1
  Bottom 0.254: J1.5 33.02,25.65 v33.27,25.65
SCK  (via drill 0.61)
  Top 0.254: v28.96,26.92 28.96,25.91 U1.17
  Bottom 0.254: v28.96,26.92 28.96,30.73 29.46,30.73 J1.3

### Text on the board
tPlace: Designed By | Eddy Hintze | 09/2014